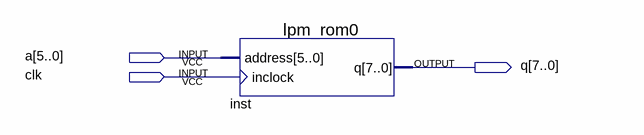
[diagram p0: schematic sheet]
// Quartus schematic Chapter1.bdf as structural Verilog: 1 symbols, 3 pins
module Chapter1 (
  input  [5:0] a,
  input  clk,
  output [7:0] q
);

  lpm_rom0 inst (.address(a), .inclock(clk), .q(q));
endmodule
